# Altium schematic sheet MCU.SchDoc
size A4; SheetNumber: 4; SheetTotal: 6
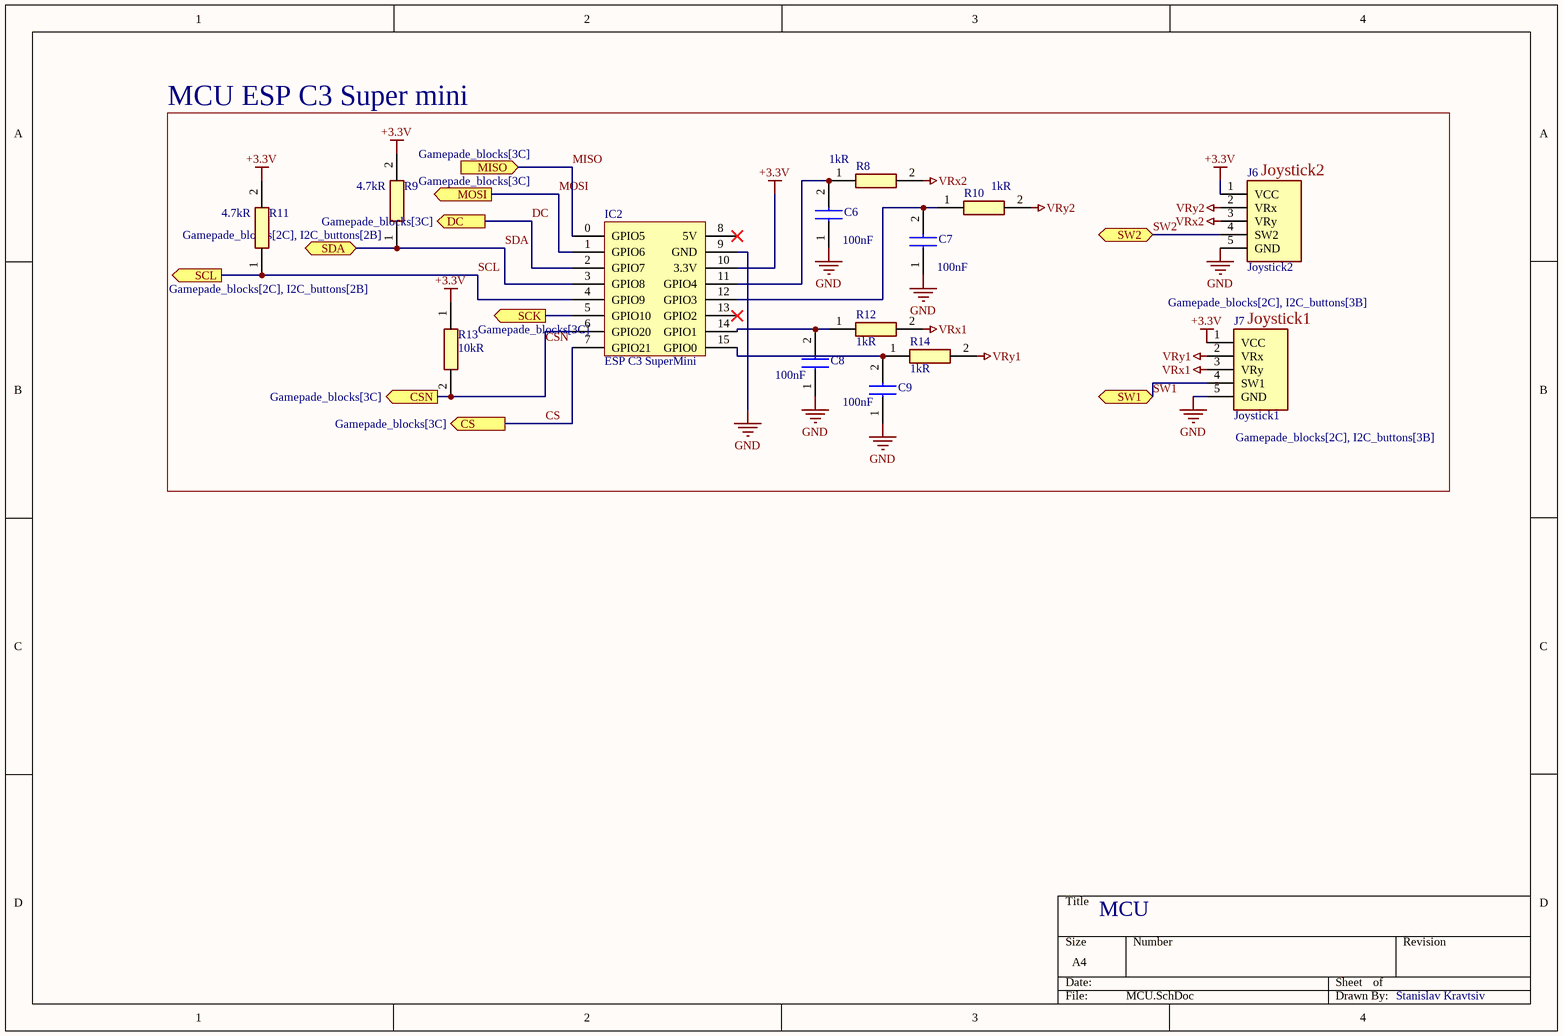
[diagram p0: MCU.SchDoc]

## Parts
C6  100nF  [CAPC1608X95N]
C7  100nF  [CAPC1608X95N]
C8  100nF  [CAPC1608X95N]
C9  100nF  [CAPC1608X95N]
IC2  ESP C3 SuperMini  [esp c3 super mini]
J6  Joystick2  [1.25_JSH-GH_5]
J7  Joystick1  [1.25_JSH-GH_5]
R8  1kR  [RESC1608X55N]
R9  4.7kR  [RESC1608X55N]
R10  1kR  [RESC1608X55N]
R11  4.7kR  [RESC1608X55N]
R12  1kR  [RESC1608X55N]
R13  10kR  [RESC1608X55N]
R14  1kR  [RESC1608X55N]

## Ports
CS (out, see Gamepade_blocks[3C]), CSN (out, see Gamepade_blocks[3C]), DC (out, see Gamepade_blocks[3C]), MISO (in, see Gamepade_blocks[3C]), MOSI (out, see Gamepade_blocks[3C]), SCK (out, see Gamepade_blocks[3C]), SCL (out, see Gamepade_blocks[2C], I2C_buttons[2B]), SDA (bidir, see Gamepade_blocks[2C], I2C_buttons[2B]), SW1 (bidir, see Gamepade_blocks[2C], I2C_buttons[3B]), SW2 (bidir, see Gamepade_blocks[2C], I2C_buttons[3B])

## Nets
+3.3V: IC2.10(3.3V) J6.1(VCC) J7.1(VCC) R9.2 R11.2 R13.1
GND: C6.1 C7.1 C8.1 C9.1 IC2.9(GND) J6.5(GND) J7.5(GND)
VRx1: J7.3(VRy) R12.2
VRx2: J6.3(VRy) R8.2
VRy1: J7.2(VRx) R14.2
VRy2: J6.2(VRx) R10.2
CS: IC2.7(GPIO21) ; port CS
CSN: IC2.6(GPIO20) R13.2 ; port CSN
DC: IC2.2(GPIO7) ; port DC
MISO: IC2.0(GPIO5) ; port MISO
MOSI: IC2.1(GPIO6) ; port MOSI
SCK: IC2.5(GPIO10) ; port SCK
SCL: IC2.4(GPIO9) R11.1 ; port SCL
SDA: IC2.3(GPIO8) R9.1 ; port SDA
SW1: J7.4(SW1) ; port SW1
SW2: J6.4(SW2) ; port SW2
NetC6_2: C6.2 IC2.11(GPIO4) R8.1
NetC7_2: C7.2 IC2.12(GPIO3) R10.1
NetC8_2: C8.2 IC2.14(GPIO1) R12.1
NetC9_2: C9.2 IC2.15(GPIO0) R14.1

Not connected (* = marked no-connect by the designer): IC2 8(5V)* 13(GPIO2)*

## Notes on the sheet
- MCU ESP C3 Super mini
- (near J6) Joystick2
- (near J7) Joystick1
- MCU
- Stanislav Kravtsiv

## Library data of the parts
C6-C9 = 0603B104K500CT: Capacitor; Manufacturer_Name: Walsin Technology Corporation; Datasheet Link: https://datasheet.datasheetarchive.com/originals/distributors/DKDS41/DSANUWW0027552.pdf; Height: 0.95mm; Manufacturer_Part_Number: 0603B104K500CT; Mouser Part Number: 791-0603B104K500CT; Mouser Price/Stock: https://www.mouser.co.uk/ProductDetail/Walsin/0603B104K500CT?qs=fIkAfuXiAQLxgNQoxkAdgw%3D%3D; Arrow Part Number: 0603B104K500CT; Arrow Price/Stock: https://www.arrow.com/en/products/0603b104k500ct/walsin-technology
IC2 = IC
J6 J7 = B5B-XH-AM__LF__SN_: Connector; Manufacturer_Name: JST (JAPAN SOLDERLESS TERMINALS); Manufacturer_Part_Number: B5B-XH-AM (LF)(SN); Datasheet Link: http://uk.rs-online.com/web/p/products/1755317; Height: 7mm; Arrow Part Number: B5B-XH-AM (LF)(SN); Arrow Price/Stock: https://www.arrow.com/en/products/b5b-xh-am-lf-sn/jst-manufacturing
R8 R10 R12 R14 = RC0603FR-071KL: Resistor; Manufacturer_Name: Yageo Group; Datasheet Link: https://www.yageo.com/upload/media/product/productsearch/datasheet/rchip/PYu-RC_Group_51_RoHS_L_12.pdf; Height: 0.55mm; Manufacturer_Part_Number: RC0603FR-071KL; Mouser Part Number: 603-RC0603FR-071KL; Mouser Price/Stock: https://www.mouser.co.uk/ProductDetail/YAGEO/RC0603FR-071KL?qs=VU8sRB4EgwApHsk4rF%2F3zg%3D%3D; Arrow Part Number: RC0603FR-071KL; Arrow Price/Stock: https://www.arrow.com/en/products/rc0603fr-071kl/yageo?utm_currency=USD&region=europe
R9 R11 = RC0603FR-074K75L: Resistor; Manufacturer_Name: Yageo Group; Datasheet Link: http://www.yageo.com/documents/recent/PYu-RC0603_51_RoHS_L_v5.pdf; Height: 0.55mm; Manufacturer_Part_Number: RC0603FR-074K75L; Mouser Part Number: 603-RC0603FR-074K75L; Mouser Price/Stock: https://www.mouser.co.uk/ProductDetail/Yageo/RC0603FR-074K75L?qs=5Z1f76oN9PMSImX%2FXUaE6Q%3D%3D; Arrow Part Number: RC0603FR-074K75L; Arrow Price/Stock: https://www.arrow.com/en/products/rc0603fr-074k75l/yageo
R13 = RC0603FR0710KL: Resistor; Manufacturer_Name: Yageo Group; Value: 10kOhm; Datasheet Link: http://www.yageo.com/documents/recent/PYu-RC0603_51_RoHS_L_v5.pdf; Height: 0.55mm; Manufacturer_Part_Number: RC0603FR0710KL; Arrow Part Number: RC0603FR0710KL; Arrow Price/Stock: https://www.arrow.com/en/products/rc0603fr-0710kl/yageo